# Altium schematic sheet powerbeveiliging.SchDoc
size A; SheetNumber: 2; SheetTotal: 2
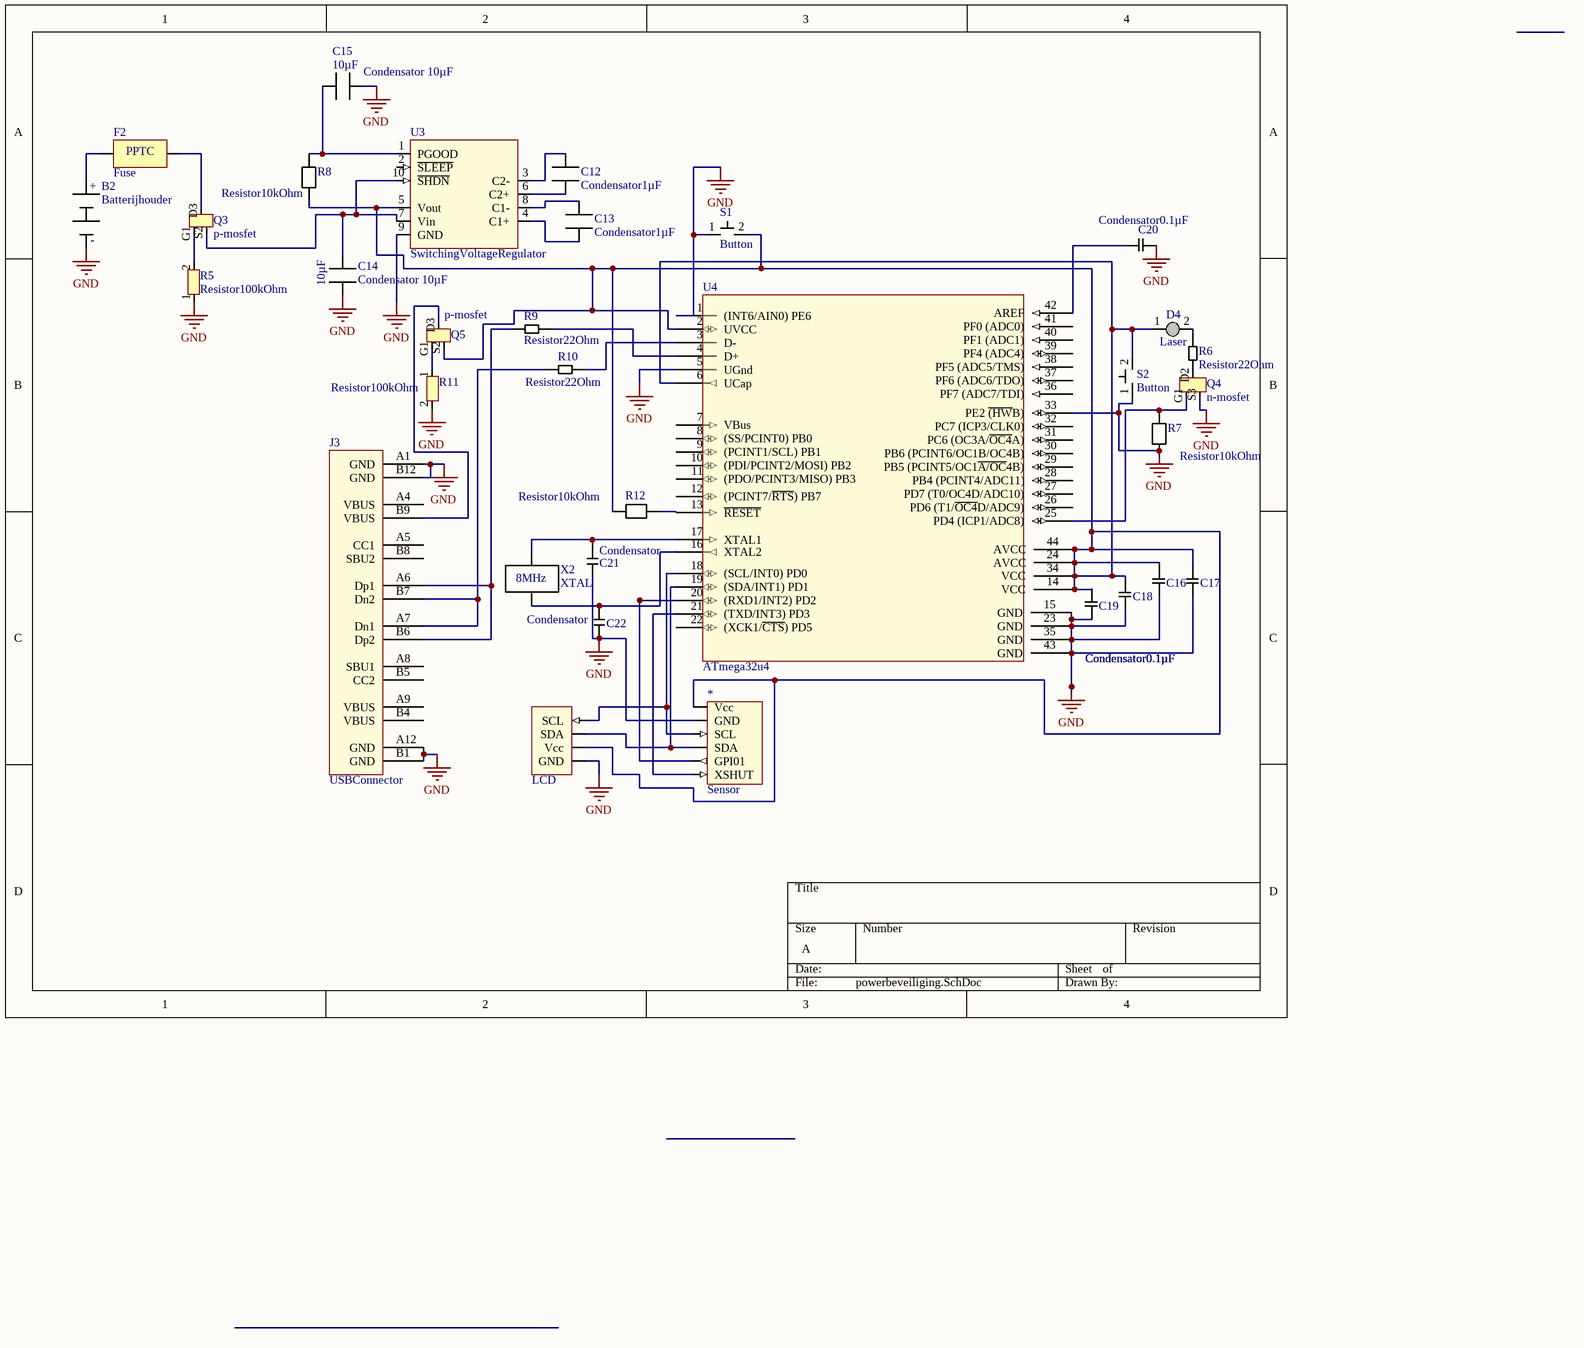
[diagram p0: powerbeveiliging.SchDoc]

## Parts
(Parts that share a designator on the sheet are numbered #1, #2 ... from top to bottom, then left to right.)
*#1  Sensor
*#2  LCD
B2  Batterijhouder
C12  Condensator1µF  [CAPC1812X18M]
C13  Condensator1µF  [CAPC1812X18M]
C14  Condensator 10µF  [CAPC0603X035M]
C15  Condensator 10µF  [CAPC0603X035M]
C16  Condensator0.1µF  [CAPC1210X70M]
C17  Condensator0.1µF  [CAPC1210X70M]
C18  Condensator0.1µF  [CAPC1210X70M]
C19  Condensator0.1µF  [CAPC1210X70M]
C20  Condensator0.1µF  [CAPC1210X70M]
C21  Condensator  [CAPC1210X14M]
C22  Condensator  [CAPC1210X14M]
D4  Laser
F2  Fuse  [RESC4632X15M]
J3  USBConnector
Q3  p-mosfet
Q4  n-mosfet
Q5  p-mosfet
R5  Resistor100kOhm
R6  Resistor22Ohm  [R0805X045M]
R7  Resistor10kOhm  [R1210X06M]
R8  Resistor10kOhm  [R1210X06M]
R9  Resistor22Ohm  [R0805X045M]
R10  Resistor22Ohm  [R0805X045M]
R11  Resistor100kOhm
R12  Resistor10kOhm  [R1210X06M]
S1  Button
S2  Button
U3  SwitchingVoltageRegulator  [SON50P300X100_HS-11M]
U4  ATmega32u4  [TQFP80P1200X1200X100_HS-45N]
X2  XTAL  [CAPC13550X20N]

## Nets
GND: *#1.2(GND) *#2.4(GND) B2.2 C14.1 C15.2 C16.1 C17.1 C18.1 C19.1 C20.2 C21.1 C22.1 J3.A1(GND) J3.A12(GND) J3.B1(GND) J3.B12(GND) Q4.S3(Source) R5.1 R7.2 R11.2 S1.1 S2.1 U3.9(GND) U4.1((INT6/AIN0)_PE6) U4.5(UGnd) U4.15(GND) U4.23(GND) U4.33(PE2_~{(HW}B)) U4.35(GND) U4.43(GND)
Net*#1_1: *#1.1(Vcc) *#2.5(Vcc) C16.2 C17.2 C18.2 C19.2 D4.1(+) Q5.S2(Source) R8.2 R12.1 S1.2 S2.2 U3.5(Vout) U4.2(UVCC) U4.6(UCap) U4.14(VCC) U4.24(AVCC) U4.34(VCC) U4.44(AVCC)
Net*#1_3: *#1.3(SCL) *#2.7(SCL) U4.18((SCL/INT0)_PD0)
Net*#1_4: *#1.4(SDA) *#2.6(SDA) U4.19((SDA/INT1)_PD1)
Net*#1_5: *#1.5(GPI01) U4.20((RXD1/INT2)_PD2)
Net*#1_6: *#1.6(XSHUT) U4.21((TXD/INT3)_PD3)
NetB2_1: B2.1 F2.1
NetC12_1: C12.1 U3.6(C2+)
NetC12_2: C12.2 U3.3(C2-)
NetC13_1: C13.1 U3.4(C1+)
NetC13_2: C13.2 U3.8(C1-)
NetC14_2: C14.2 Q3.S2(Source) U3.7(Vin) U3.10(~{SHDN})
NetC15_1: C15.1 R8.1 U3.1(PGOOD)
NetC20_1: C20.1 U4.42(AREF)
NetC21_2: C21.2 U4.17(XTAL1) X2.1(Xtal_1)
NetC22_2: C22.2 U4.16(XTAL2) X2.2(Xtal__2)
NetD4_2: D4.2(-) R6.2
NetF2_2: F2.2 Q3.D3
NetJ3_A6: J3.A6(Dp1) J3.B6(Dp2) R9.1
NetJ3_A7: J3.A7(Dn1) J3.B7(Dn2) R10.1
NetJ3_B9: J3.B9(VBUS) Q5.D3
NetQ3_G1: Q3.G1(Gate) R5.2
NetQ4_D2: Q4.D2(D) R6.1
NetQ4_G1: Q4.G1(Gate) R7.1 U4.25(PD4_(ICP1/ADC8))
NetQ5_G1: Q5.G1(Gate) R11.1
NetR9_2: R9.2 U4.4(D+)
NetR10_2: R10.2 U4.3(D-)
NetR12_2: R12.2 U4.13(~{RESET})

Not connected (* = marked no-connect by the designer): J3 A4(VBUS) A5(CC1) A8(SBU1) A9(VBUS) B4(VBUS) B5(CC2) B8(SBU2); U3 2(~{SLEEP}); U4 7(VBus) 8((SS/PCINT0)_PB0) 9((PCINT1/SCL)_PB1) 10((PDI/PCINT2/MOSI)_PB2) 11((PDO/PCINT3/MISO)_PB3) 12((PCINT7/~{RTS})_PB7) 22((XCK1/~{CTS})_PD5) 26(PD6_(T1/~{OC4}D/ADC9)) 27(PD7_(T0/OC4D/ADC10)) 28(PB4_(PCINT4/ADC11)) 29(PB5_(PCINT5/OC1~{A/OC}4B)) 30(PB6_(PCINT6/OC1B/OC4B)) 31(PC6_(OC3A/~{OC4}A)) 32(PC7_(ICP3/CLK0)) 36(PF7_(ADC7/TDI)) 37(PF6_(ADC6/TDO)) 38(PF5_(ADC5/TMS)) 39(PF4_(ADC4)) 40(PF1_(ADC1)) 41(PF0_(ADC0))

## Notes on the sheet
- (in symbol Batterijhouder) +; -
- (in symbol Condensator 10µF) 10µF
- (in symbol Fuse) PPTC
- (in symbol XTAL) 8MHz